# EAGLE design MXR1_v1 (EAGLE 7.1.0)
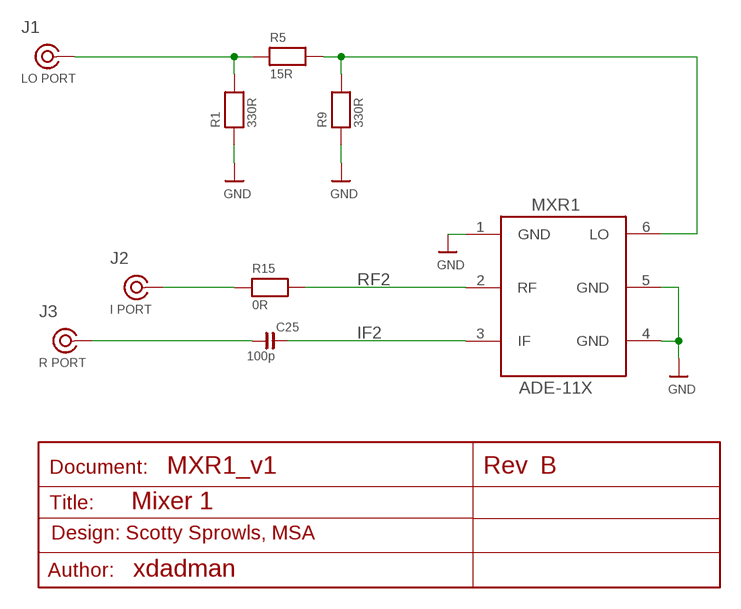
[diagram p0: schematic, sheet 1]

## Parts
C25  100p  C0805100P  [C0805]
J1  LO PORT  COAX  [SLIM_COAX_PAD]
J2  I PORT  COAX  [SLIM_COAX_PAD]
J3  R PORT  COAX  [SLIM_COAX_PAD]
MXR1  ADE-11X  [ADE-11X]
R1  330R  R0805330R  [R0805]
R5  15R  R080515R  [0805]
R9  330R  R0805330R  [R0805]
R15  0R  R08050R  [R0805]

## Nets
GND: MXR1.1(GND) MXR1.4(GND) MXR1.5(GND) R1.1 R9.1
IF: C25.1 J3.SIG
IF2: C25.2 MXR1.3(IF)
LO: J1.SIG R1.2 R5.1
LO3: MXR1.6(LO) R5.2 R9.2
RF: J2.SIG R15.1
RF2: MXR1.2(RF) R15.2

## Notes on the sheet
- B
- Mixer 1
- Design: Scotty Sprowls, MSA
- xdadman

## Power pins joined to a net without a drawn wire
GND: J1.GND J2.GND J3.GND

## Library data of the parts
C25 = MSA_lib:C0805: Ceramic capacitor; OC_FARNELL: 1414656
J1-J3 = MSA_lib:COAX
MXR1 = MSA_lib:ADE-11X: RF Mixer; VENDOR: minicirquits
R1 R9 = MSA_lib:R0805: Resistors; OC_FARNELL: 2078951
R5 = MSA_lib:R0805: Resistors; OC_FARNELL: 2332045
R15 = MSA_lib:R0805: Resistors; OC_FARNELL: 2057661

## Board

Size 32 x 32 mm. Coordinates in mm from the lower left corner, seen from the top.
Outline: 0,0 32,0 32,32 0,32 0,0
Copper layers (1*16): Top 0.035mm / dielectric 1.5mm / Bottom 0.035mm
Design rules "kuba_no_CLR": minimum track width 8mil, minimum drill 15mil, track to track 8mil, track to pad 8mil, pad to pad 8mil, via to via 8mil, smd to smd 8mil, copper to edge 0mil, drill to drill 8mil, minimum pad ring 12mil, minimum via ring 10mil, stop-mask expansion 4mil, vias tented up to drill 0mil, thermal gap 10mil

### Footprints (pad centres in the part's own frame; a part is rotated, then mirrored left to right if it is on the bottom)
C0805 = smd 1.2 x 1.5: 1 -0.953,0; 2 0.953,0
SLIM_COAX_PAD = smd 1.27 x 0.635 bottom: GND 0,-2.667 | drill 1.1: SIG 0,0
ADE-11X = smd 1.65 x 2.54: 1 -2.54,-2.54; 2 0,-2.54; 3 2.54,-2.54; 4 2.54,2.54; 5 0,2.54; 6 -2.54,2.54
R0805 = smd 1.3 x 1.5: 1 -0.95,0; 2 0.95,0
0805 = smd 1.3 x 1.5: 1 -0.95,0; 2 0.95,0

### Placement (x,y rotation side)
C25  20.07,12.7 180 top
J1  10.29,24.26 270 top
J2  8.71,7.19 0 top
J3  25.91,12.7 90 top
MXR1  18.16,18.16 270 top
R1  8.26,24.26 0 top
R5  16.26,24.26 0 top
R9  22.35,24.26 180 top
R15  8.61,12.67 90 top

### Tracks (layer width: path | path; a pad name or v marks a point on that pad's centre or on a via)
GND  (via drill 0.5)
  Top 0.406: MXR1.1 15.62,20.32 | 20.19,18.67 MXR1.5 MXR1.4
  Bottom 0.61: J1.GND R1.1
  other vias: 6.6,24.89 1.78,30.23 2.03,24.64 2.03,17.78 2.03,11.18 2.03,6.35 2.03,1.78 5.84,30.23 10.41,30.23 14.73,30.23 20.32,30.23 26.42,30.23 29.97,30.23 6.1,1.78 10.67,1.78 15.49,1.78 20.07,1.78 24.89,1.78 30.23,1.78 30.23,5.59 30.23,9.4 30.23,13.46 30.23,18.03 30.23,22.1 29.97,26.16 5.59,4.32 8.89,4.32 11.94,4.32 11.94,7.62 11.94,10.67 11.94,13.21 11.94,15.49 13.97,7.62 17.78,7.62 21.59,7.62 25.4,7.62 27.18,15.75 23.62,15.75 18.29,15.24 20.32,15.49 18.29,16.51 18.29,17.78 18.03,19.3 17.02,21.08 14.48,21.08 11.43,21.08 8.64,21.08 6.6,22.61 6.6,27.43 23.62,24.13
  pour Top (no thermals): 10.79,0.1 10.79,16.18 13.39,16.18 13.39,0.1
  pour Top (no thermals): 0.86,19.91 16.79,19.91 16.79,22.25 0.86,22.25
  pour Top (no thermals): 27.94,14.73 17.81,14.73 17.81,19.94 16.76,19.94 16.76,22.23 18.29,22.23 18.29,18.92 22.99,18.92 22.99,28.07 0,28.07 0,32 32,32 32,0 27.94,0
  pour Top (no thermals): 0,32 0,0 32,0 32,9.02 13.46,9.02 13.46,4.95 4.83,4.95 4.83,21.97 8,21.97 8,28.32 4.45,28.32 4.45,32
  pour Bottom: 0,0 0,32 32,32 32,0
IF
  Top 0.203: 22.73,12.7 C25.1
  Top 2.21: J3.SIG 22.73,12.7
  pour Top (no thermals): 20.45,11.71 20.45,13.72 22.99,13.72 22.99,11.71
IF2
  Top 0.203: C25.2 15.75,12.7 15.62,12.7 14.99,12.7 14.99,15.49 14.48,15.49 14.48,15.62 MXR1.3
  pour Top (no thermals): 14.43,12.19 14.43,16 16.84,16.03 16.84,12.22
  pour Top (no thermals): 14.43,11.76 14.43,13.72 19.68,13.72 19.68,11.76
LO
  Top 0.203: 13.59,24.26 R5.1 | R1.2 10.79,24.26
  Top 2.21: 10.79,24.26 13.59,24.26
  Top 2.54: J1.SIG 10.79,24.26
  pour Top (no thermals): 13.44,23.27 15.77,23.27 15.77,25.27 13.44,25.27
LO3
  Top 0.203: R9.2 21.34,24.26
  Top 0.406: R5.2 21.34,24.26 | 21.34,24.26 21.34,20.7 MXR1.6 | 21.34,24.77 21.34,24.26
  pour Top (no thermals): 19.38,20.45 19.38,24.26 21.89,24.26 21.89,20.45
  pour Top (no thermals): 16.61,23.27 21.87,23.27 21.87,25.27 16.61,25.27
N$1
  pour Top (no thermals): 14.58,10.01 14.58,10.82 19.2,10.82 19.2,10.01
N$2
  pour Top (no thermals): 21.18,10.01 21.18,10.82 25.81,10.82 25.81,10.01
N$3
  pour Top (no thermals): 10.77,26.26 10.77,27.08 15.39,27.08 15.39,26.26
N$4
  pour Top (no thermals): 16.87,26.26 16.87,27.08 21.49,27.08 21.49,26.26
N$5
  pour Top (no thermals): 6.63,7.59 5.82,7.59 5.82,12.22 6.63,12.22
N$6
  pour Top (no thermals): 6.63,14.2 5.82,14.2 5.82,18.82 6.63,18.82
RF
  Top 0.203: 8.69,10.36 8.61,10.36 R15.1
  Top 2.21: 8.69,7.19 8.69,10.36
  Top 2.54: J2.SIG 8.69,7.19
  pour Top (no thermals): 7.67,9.83 9.7,9.83 9.7,12.37 7.67,12.37
RF2
  Top 0.203: MXR1.2 8.61,18.16 R15.2
  pour Top (no thermals): 7.67,12.93 9.68,12.93 9.68,18.9 7.67,18.9
  pour Top (no thermals): 8.61,18.9 14.45,18.9 14.45,17.2 8.61,17.2

### Text on the board
tPlace: J1-LO | R5 | R9 | R1 | MXR1 | J3-R | R15 | C25 | J2-I | Mixer 1 | C:/temp/eemg_logo.bmp